# EAGLE design 13P_Connector (EAGLE 7.6.0)
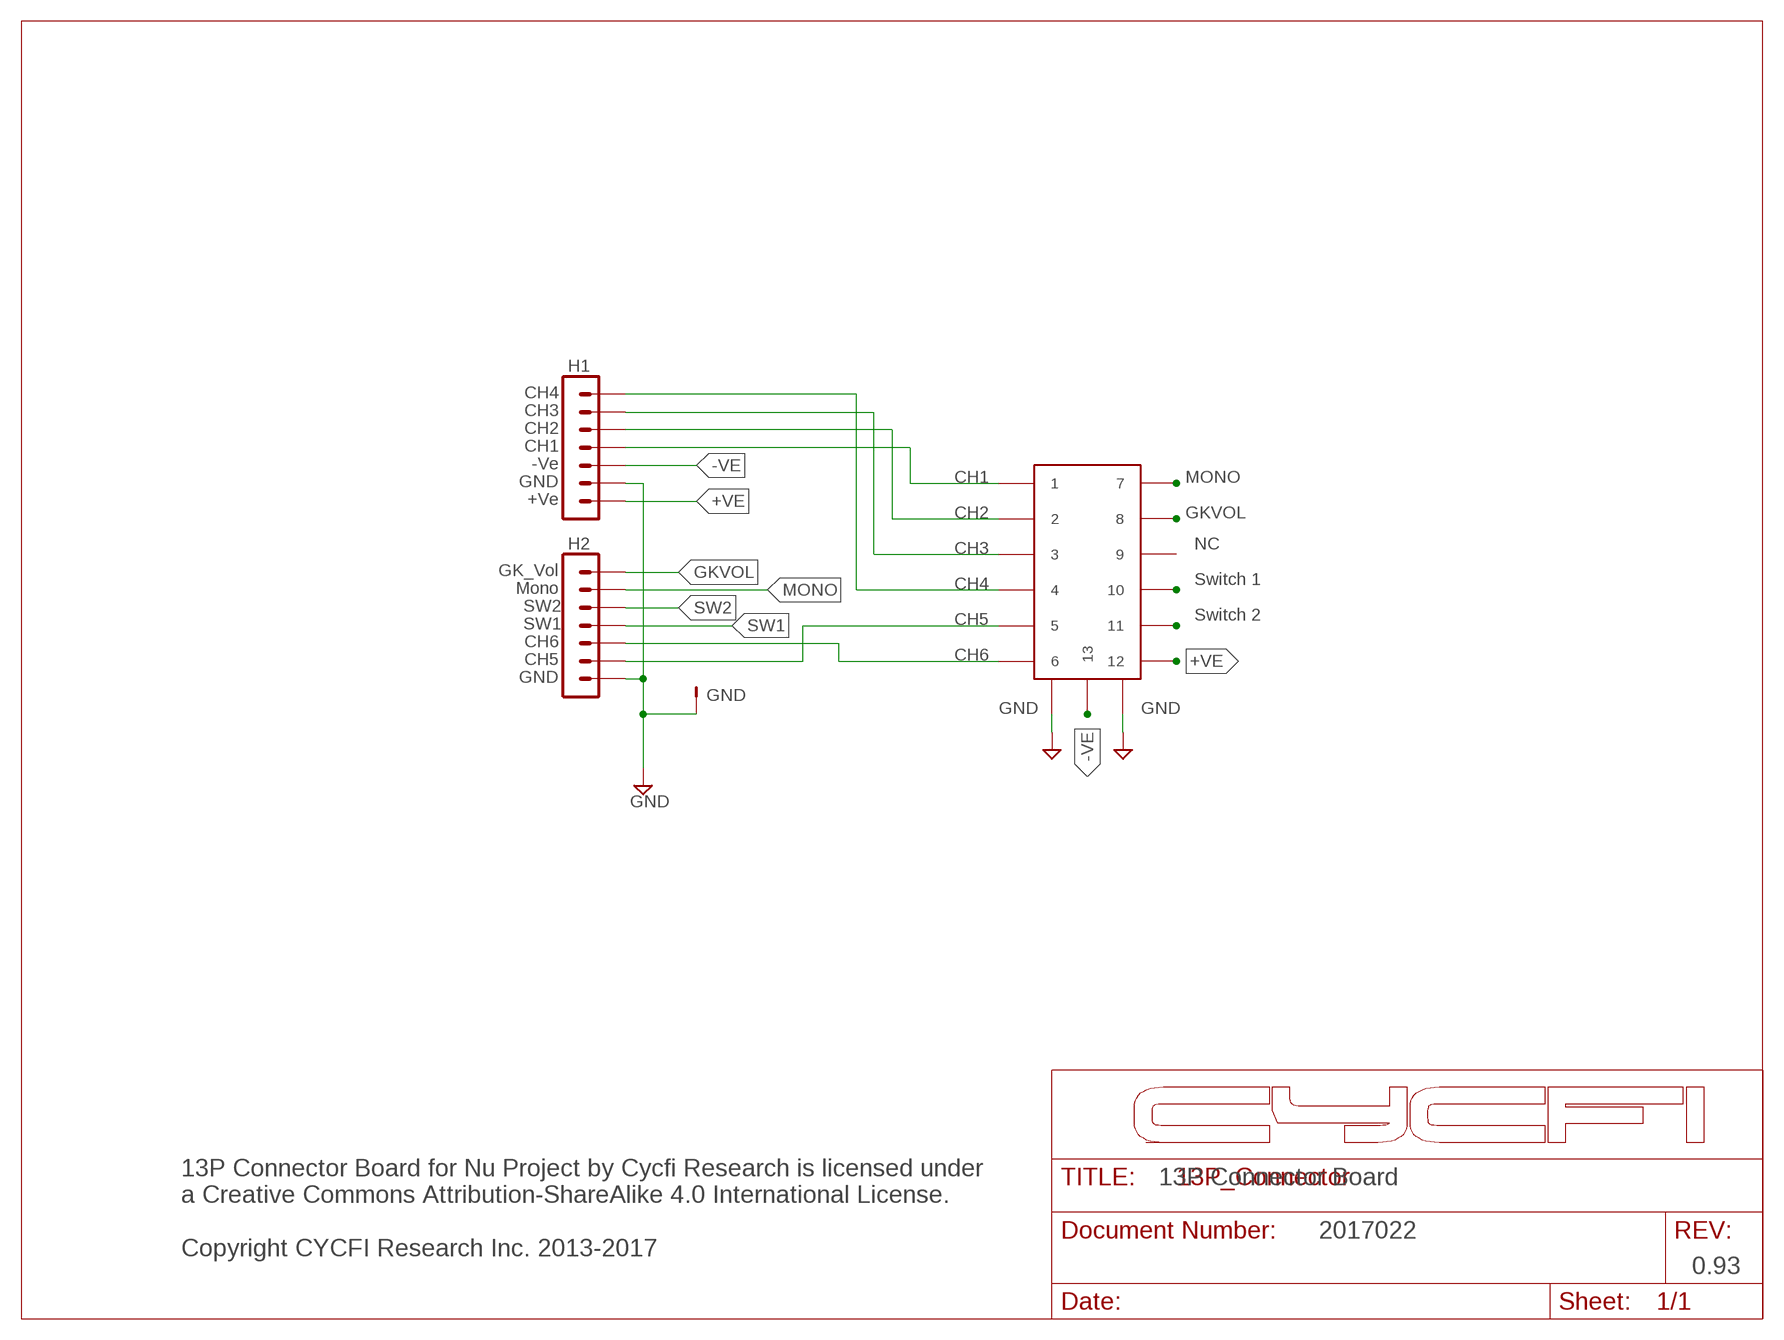
[diagram p0: schematic, sheet 1]

## Parts
13P_DIN  J1  13P-MIDI  [13P-MIDI]
GND  TH-PAD-1.6/0.8  [TH-PAD-1.6/0.8]
H1  7P_ZIF_59453-071110EDHLF  [7P_ZIF_59453-071110EDHLF]
H2  7P_ZIF_59453-071110EDHLF  [7P_ZIF_59453-071110EDHLF]

## Nets
+VE: 13P_DIN.12 H1.P$7
-VE: 13P_DIN.13 H1.P$5
GKVOL: 13P_DIN.8 H2.P$1
GND: 13P_DIN.P$14 13P_DIN.P$15 GND.1(P) H1.P$6 H2.P$7
MONO: 13P_DIN.7 H2.P$2
N$1: 13P_DIN.6 H2.P$5
N$2: 13P_DIN.5 H2.P$6
N$3: 13P_DIN.1 H1.P$4
N$4: 13P_DIN.2 H1.P$3
N$5: 13P_DIN.3 H1.P$2
N$6: 13P_DIN.4 H1.P$1
SW1: 13P_DIN.10 H2.P$4
SW2: 13P_DIN.11 H2.P$3
Unconnected: 13P_DIN.9

## Notes on the sheet
- CH4
- CH3
- CH2
- CH1
- -Ve
- GND | CH1
- +Ve
- CH2
- CH3 | NC
- GK_Vol
- CH4 | Switch 1
- Mono
- SW2
- CH5 | Switch 2
- SW1
- CH6
- CH5 | CH6
- GND
- 13P Connector Board
- 2017022
- 13P Connector Board for Nu Project by Cycfi Research is licensed under 
  a Creative Commons Attribution-ShareAlike 4.0 International License.
  
  Copyright CYCFI Research Inc. 2013-2017
- 0.93

## Library data of the parts
13P_DIN = CYCFI_Con:13P-MIDI
GND = CYCFI_Con:TH-PAD-1.6/0.8
H1 H2 = CYCFI_Con:7P_ZIF_59453-071110EDHLF

## Board
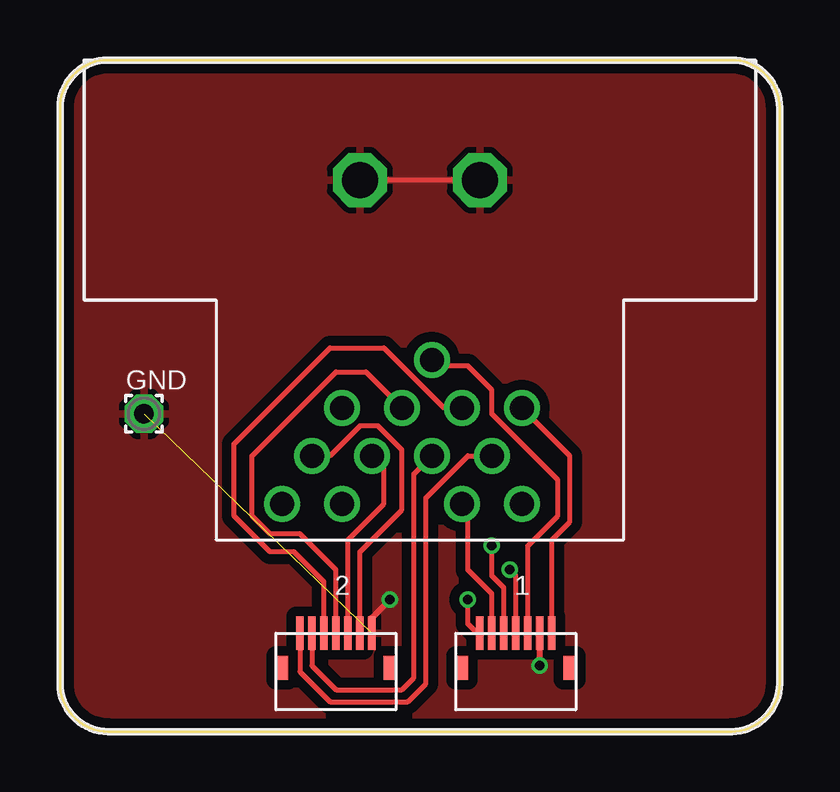
[diagram p1: board, top side]
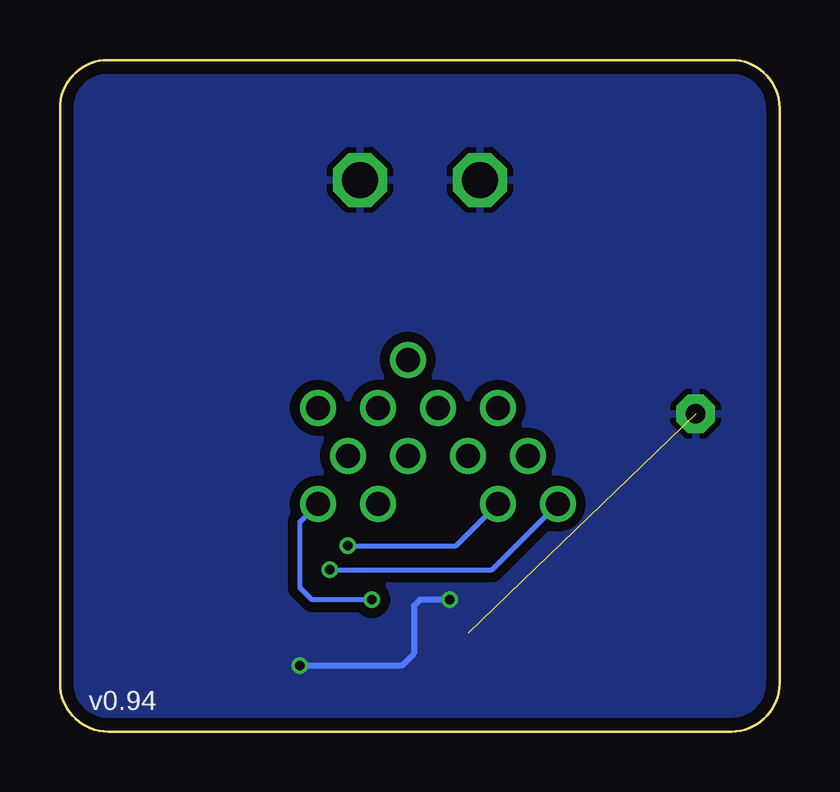
[diagram p2: board, bottom side, seen from below]

Size 30 x 28 mm. Coordinates in mm from the lower left corner, seen from the top.
Outline: 0,26 0,2 arc90 2,0 28,0 arc90 30,2 30,26 arc90 28,28 2,28 arc90 0,26
Copper layers (1*16): Top 0.035mm / dielectric 1.6mm / Bottom 0.035mm
Design rules "Elecrow_2-layer_PCB_eagle_rule": minimum track width 6mil, minimum drill 12mil, track to track 6mil, track to pad 8mil, pad to pad 12mil, via to via 12mil, smd to smd 0mil, copper to edge 20mil, drill to drill 10mil, minimum pad ring 6mil, minimum via ring 6mil, stop-mask expansion 0mil, vias tented up to drill 100mil, thermal gap 10mil

### Footprints (pad centres in the part's own frame; a part is rotated, then mirrored left to right if it is on the bottom)
13P-MIDI = drill 1: 1 5.75,13.5; 2 3.25,13.5; 3 -1.75,13.5; 4 -4.25,13.5; 5 4.5,11.5; 6 2,11.5; 7 -0.5,11.5; 8 -3,11.5; 9 3.25,9.5; 10 0.75,9.5; 11 -1.75,9.5; 12 -4.25,9.5; 13 -0.5,7.5 | drill 1.5 octagon: P$14 -2.5,0; P$15 2.5,0
TH-PAD-1.6/0.8 = drill 0.813 pad 1.6 octagon: 1 0,0
7P_ZIF_59453-071110EDHLF = smd 0.3 x 1.4: P$1 -1.5,1.6; P$2 -1,1.6; P$3 -0.5,1.6; P$4 0,1.6; P$5 0.5,1.6; P$6 1,1.6; P$7 1.5,1.6 | smd 0.52 x 1: ST1 -2.24,0.15; ST2 2.24,0.15

### Placement (x,y rotation side)
13P_DIN  15,23 180 top
GND  3.5,13.25 0 top
H1  19,2.5 0 top
H2  11.5,2.5 0 top

### Tracks (layer width: path | path; a pad name or v marks a point on that pad's centre or on a via)
+VE
  Top 0.203: H1.P$7 20.5,8 21.25,8.75 21.25,11.5 13P_DIN.12
-VE
  Top 0.203: H1.P$5 19.5,7.75 20.75,9 20.75,10.5 18,13.25 18,14.25 17,15.25 15.75,15.25 13P_DIN.13
GKVOL
  Top 0.203: H2.P$1 10,2.5 11.25,1.25 14.5,1.25 15.25,2 15.25,9.75 17,11.5 13P_DIN.8
GND  (via drill 0.4)  (1 unrouted)
  Top 0.203: 13P_DIN.P$14 13P_DIN.P$15
  Top 0.254: H2.P$7 13,4.75 v13.75,5.5 | v20,2.75 H1.P$6
  Bottom 0.254: v13.75,5.5 15,5.5 15.25,5.25 15.25,3.25 15.75,2.75 v20,2.75
  pour Top (isolate 0.406): 0,26 0,2 arc90 2,0 28,0 arc90 30,2 30,26 arc90 28,28 2,28 arc90
  pour Bottom (isolate 0.406): 0,26 0,2 arc90 2,0 28,0 arc90 30,2 30,26 arc90 28,28 2,28 arc90
MONO
  Top 0.203: H2.P$2 10.5,2.75 11.5,1.75 14.25,1.75 14.75,2.25 14.75,10.75 13P_DIN.7
N$1
  Top 0.203: H2.P$5 12,8 13.5,9.5 13.5,11 13P_DIN.6
N$2
  Top 0.203: H2.P$6 12.5,7.5 14.25,9.25 14.25,11.75 13.25,12.75 12.5,12.75 11.25,11.5 13P_DIN.5
N$3  (via drill 0.4)
  Top 0.203: H1.P$4 19,6.5 v18.75,6.75
  Bottom 0.203: v18.75,6.75 12,6.75 13P_DIN.1
N$4  (via drill 0.4)
  Top 0.203: H1.P$3 18.5,6 18,6.5 v18,7.75
  Bottom 0.203: v18,7.75 13.5,7.75 13P_DIN.2
N$5
  Top 0.203: H1.P$2 18,5.75 17,6.75 17,9.25 13P_DIN.3
N$6  (via drill 0.4)
  Top 0.203: H1.P$1 17.4,4.1 17,4.5 v17,5.5
  Bottom 0.203: v17,5.5 19.5,5.5 20,6 20,8.75 13P_DIN.4
SW1
  Top 0.203: H2.P$4 11.5,6.75 10,8.25 8.75,8.25 8,9 8,11.5 11.5,15 12.75,15 13P_DIN.10
SW2
  Top 0.203: H2.P$3 11,6.25 9.75,7.5 8.75,7.5 7.25,9 7.25,12 11.25,16 13.5,16 16,13.5 13P_DIN.11

### Text on the board
tNames: 2 | 1
bNames: v0.94